# EAGLE design TrinketTrigger (EAGLE 9.6.0)
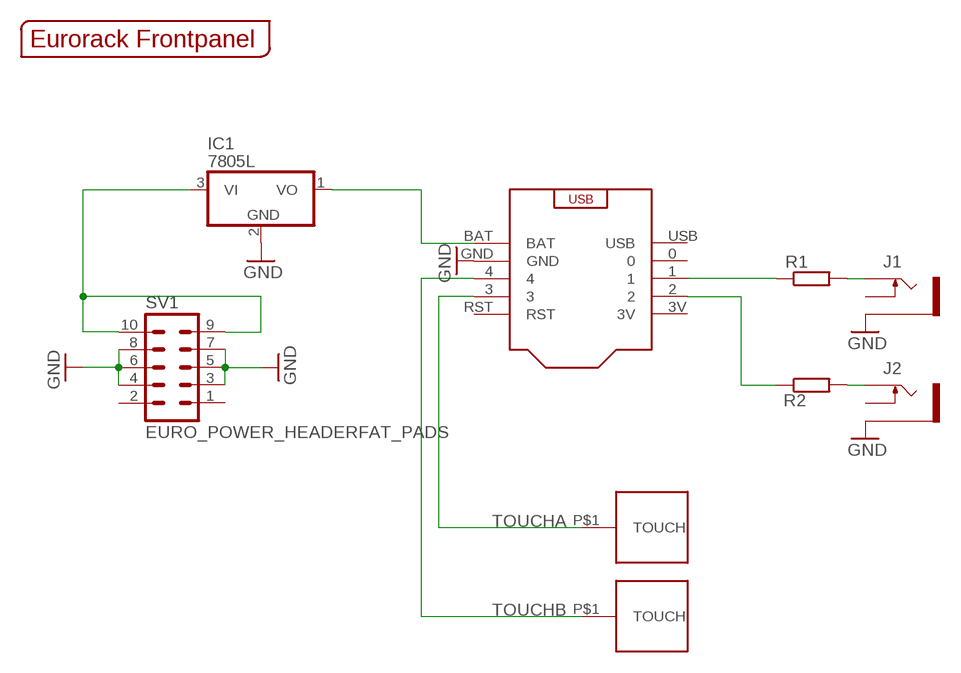
[diagram p0: schematic, sheet 1]

## Parts
IC1  7805L  [TO92]
J1  THONKICONNNEW  [WQP-PJ301M-12_JACK]
J2  THONKICONNNEW  [WQP-PJ301M-12_JACK]
R1  R-EU_0204/5  [0204/5]
R2  R-EU_0204/5  [0204/5]
SV1  EURO_POWER_HEADERFAT_PADS  [EURO_PWR_HEADER_FAT]
U$1  EURORACK_PANEL6HP  [EURORACK6HPPANEL]
U$2  TRINKETM0NH  [TRINKETMO_NOHOLES]
U$3  TOUCHPADA  [TOUCHPADA]
U$4  TOUCHPADA  [TOUCHPADA]

## Nets
GND: IC1.2(GND) J1.P$3_SLEEVE(SLEEVE) J2.P$3_SLEEVE(SLEEVE) SV1.3 SV1.4 SV1.5 SV1.6 SV1.7 SV1.8 U$2.GND
N$1: J1.P$1_TIP(TIP) R1.2
N$4: J2.P$1_TIP(TIP) R2.2
N$5: IC1.1(VO) U$2.BAT
N$6: IC1.3(VI) SV1.9 SV1.10
N$7: R1.1 U$2.1
N$8: R2.1 U$2.2
TOUCHA: U$2.3 U$3.P$1(TOUCH)
TOUCHB: U$2.4 U$4.P$1(TOUCH)
Unconnected: J1.P$2_SWITCH(SWITCH) J2.P$2_SWITCH(SWITCH) SV1.1 SV1.2 U$2.0 U$2.3V U$2.RST U$2.USB

## Library data of the parts
IC1 = adafruit:78*: Positive VOLTAGE REGULATOR Added bigger pads to the TO-92 package
J1 J2 = MusicThingModular:THONKICONN: 3.5mm socket for Eurorack modular synths
R1 R2 = rcl:R-EU_: RESISTOR, European symbol; SPICEPREFIX: R
SV1 = MusicThingModular:EURO_POWER_HEADER: Power Header 10 pin power header for Eurorack Power Supplies Variants with fatter pads for easier soldering, and the LOCK variant which has 5mil offset pins to hold the component in place before soldering
U$1 = EurorackModularParts:EURORACK_PANEL
U$2 = todstuff:TRINKETM0
U$3 U$4 = todstuff:TOUCHPAD

## Board
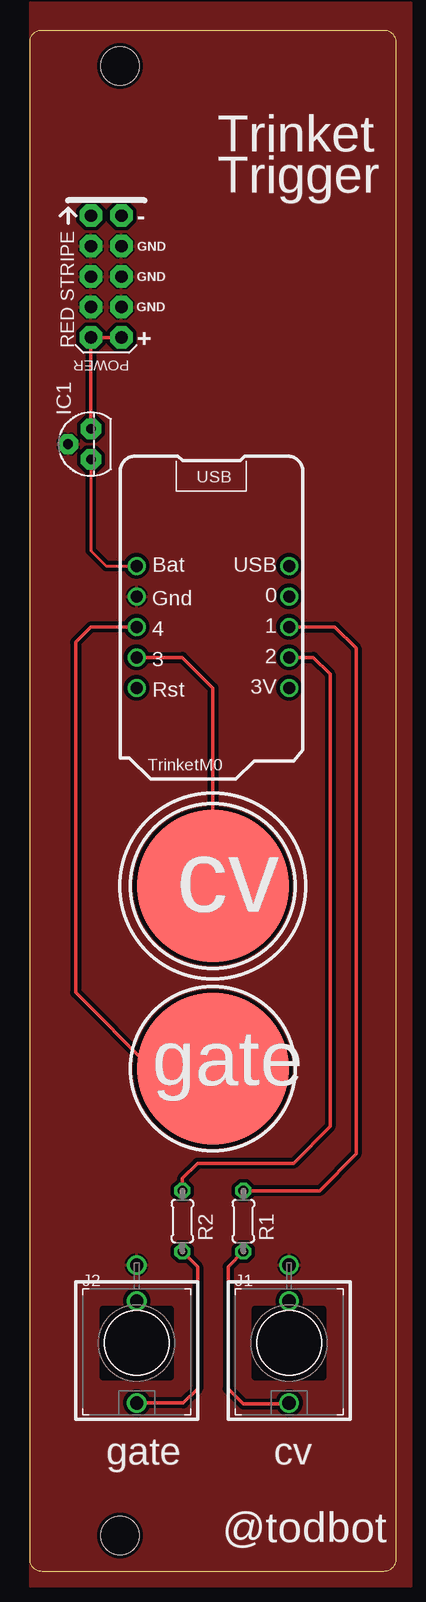
[diagram p1: board, top side]

Size 30.48 x 128.5 mm. Coordinates in mm from the lower left corner, seen from the top.
Copper layers (1*16): Top 0.035mm / dielectric 1.5mm / Bottom 0.035mm
Design rules "OthermillDRC_30_deg_v2": minimum track width 6mil, minimum drill 0.8mm, track to track 6mil, track to pad 6mil, pad to pad 6mil, via to via 6mil, smd to smd 0mil, copper to edge 0mil, drill to drill 6mil, minimum pad ring 10mil, minimum via ring 10mil, stop-mask expansion 1mil, vias tented up to drill 30mil, thermal gap 6mil

### Footprints (pad centres in the part's own frame; a part is rotated, then mirrored left to right if it is on the bottom)
TO92 = drill 0.813 pad 1.676 octagon: 1 -1.27,0; 2 0,1.905; 3 1.27,0
WQP-PJ301M-12_JACK = drill 1.1: P$1_TIP 0,5; P$2_SWITCH 0,-3.5; P$3_SLEEVE 0,-6.5
0204/5 = drill 0.813 octagon: 1 -2.54,0; 2 2.54,0
EURO_PWR_HEADER_FAT = drill 1.016 pad 1.88 octagon: 1 -5.08,-1.27; 2 -5.08,1.27; 3 -2.54,-1.27; 4 -2.54,1.27; 5 0,-1.27; 6 0,1.27; 7 2.54,-1.27; 8 2.54,1.27; 9 5.08,-1.27; 10 5.08,1.27
EURORACK6HPPANEL = hole 3.2: 7.5,3; 7.5,125.5
TRINKETMO_NOHOLES = drill 1: 0 -2.54,6.35; 1 0,6.35; 2 2.54,6.35; 3 2.54,-6.35; 3V 5.08,6.35; 4 0,-6.35; BAT -5.08,-6.35; GND -2.54,-6.35; RST 5.08,-6.35; USB -5.08,6.35
TOUCHPADA = smd 12.7 x 12.7: P$1 0,0

### Placement (x,y rotation side)
IC1  5.08,93.98 90 top
J1  21.59,19.05 180 top
J2  8.89,19.05 180 top
R1  17.78,29.21 270 top
R2  12.7,29.21 270 top
SV1  6.35,107.95 270 top
U$1  0,0 0 top
U$2  15.24,78.74 270 top
U$3  15.24,57.15 0 top
U$4  15.24,41.91 0 top

### Tracks (layer width: path | path; a pad name or v marks a point on that pad's centre or on a via)
GND
  pour Top (isolate 0.305): 0,130.81 31.75,130.81 31.75,-1.27 0,-1.27
N$1
  Top 0.305: R1.2 16.51,25.4 16.51,15.24 17.78,13.97 21.51,13.97 J1.P$1_TIP
N$4
  Top 0.305: R2.2 13.97,25.4 13.97,15.24 12.78,14.05 J2.P$1_TIP
N$5
  Top 0.254: IC1.1 5.08,85.09 6.35,83.82 U$2.BAT
N$6
  Top 0.305: SV1.10 SV1.9 IC1.3
N$7
  Top 0.305: U$2.1 25.4,78.74 27.18,76.96 27.18,34.8 24.13,31.75 R1.1
N$8
  Top 0.305: U$2.2 23.62,76.2 25.02,74.8 25.02,37.08 21.97,34.04 13.97,34.04 12.7,32.77 R2.1
TOUCHA
  Top 0.305: U$2.3 12.7,76.2 15.24,73.66 U$3.P$1
TOUCHB
  Top 0.305: U$2.4 5.08,78.74 3.81,77.47 3.81,48.26 10.16,41.91 U$4.P$1

### Text on the board
tPlace: cv | gate | gate | cv
tNames: Trinket | Trigger | @todbot